# Altium schematic sheet T-LOG v1.1.SchDoc
size 209 x 297 mm
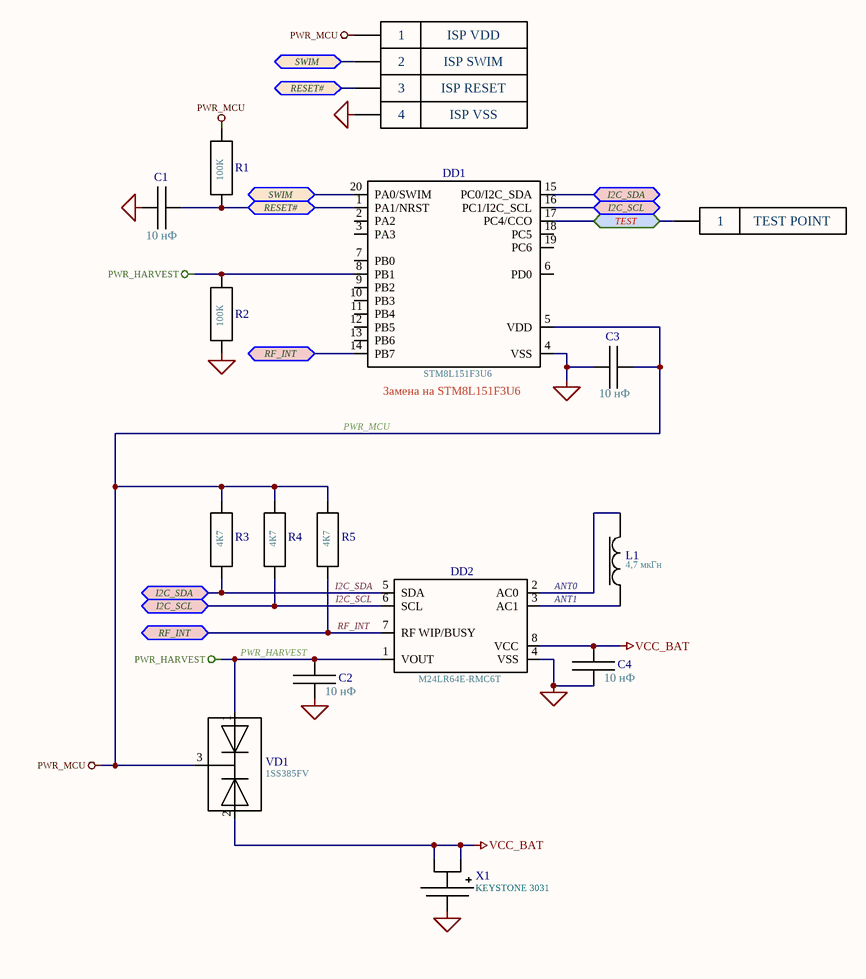
[diagram p0: T-LOG v1.1.SchDoc]

## Parts
C1  10 нФ  [C0402]
C2  10 нФ  [C0402]
C3  10 нФ  [C0402]
C4  10 нФ  [C0402]
DD1  STM8L151F3U6  [UFQPN20_3x3_0.5]
DD2  M24LR64E-RMC6T  [UDFN-8_2X3]
K1  ISP  [THRU_HOLE_02x045]  (value not drawn)  (no BOM)
K2  ISP  [THRU_HOLE_02x045]  (value not drawn)  (no BOM)
K3  ISP  [THRU_HOLE_02x045]  (value not drawn)  (no BOM)
K4  ISP  [THRU_HOLE_02x045]  (value not drawn)  (no BOM)
K5  TEST POINT  [THRU_HOLE_02x045]  (value not drawn)  (no BOM)
L1  4,7 мкГн  [WE-LQ_1210]
R1  100К  [R0402]
R2  100К  [R0402]
R3  4К7  [R0402]
R4  4К7  [R0402]
R5  4К7  [R0402]
VD1  1SS385FV  [SOT-723]
X1  KEYSTONE 3031  [KEYSTONE_3031]

## Ports
I2C_SCL (bidir), I2C_SDA (bidir), RESET# (bidir), RF_INT (bidir), SWIM (bidir), TEST (bidir)

## Nets
GND: C1.1 C2.1 C3.2 C4.1 DD1.4(VSS) DD2.4(VSS) K4.1 R2.1 X1.3
PWR_HARVEST: C2.2 DD1.8(PB1) DD2.1(VOUT) R2.2 VD1.1
PWR_MCU: C3.1 DD1.5(VDD) K1.1 R1.2 R3.2 R4.2 R5.2 VD1.3
VCC_BAT: C4.2 DD2.8(VCC) VD1.2 X1.1 X1.2
ANT0: DD2.2(AC0) L1.2
ANT1: DD2.3(AC1) L1.1
I2C_SCL: DD1.16(PC1/I2C_SCL) DD2.6(SCL) R4.1 ; port I2C_SCL
I2C_SDA: DD1.15(PC0/I2C_SDA) DD2.5(SDA) R3.1 ; port I2C_SDA
RESET#: C1.2 DD1.1(PA1/NRST) K3.1 R1.1 ; port RESET#
RF_INT: DD1.14(PB7) DD2.7(RF_WIP/BUSY) R5.1 ; port RF_INT
SWIM: DD1.20(PA0/SWIM) K2.1 ; port SWIM
TEST: DD1.17(PC4/CCO) K5.1 ; port TEST

Not connected (* = marked no-connect by the designer): DD1 2(PA2) 3(PA3) 6(PD0) 7(PB0) 9(PB2) 10(PB3) 11(PB4) 12(PB5) 13(PB6) 18(PC5) 19(PC6)

## Notes on the sheet
- 1
- 2
- ISP VDD
- ISP SWIM
- 3
- 4
- ISP RESET
- ISP VSS
- (near K5) 1
- TEST POINT
- (near DD1) Замена на STM8L151F3U6
- Перв. Примен.
- Справ. №
- Н.контр.
- Подп и дата
- Инв.№ дубл.
- Взам. инв.№
- Изм.
- Лист
- № докум.
- Подп.
- Дата
- Лит.
- Масса.
- Масштаб
- Пров.
- Т.Контр.
- Разраб.
- Схема электрическая
- принципиальная
- Листов
- б/м
- Инв.№подп.
- Н.Контр.
- Утв.
- Копировал:
- Формат А4

## Library data of the parts
C1-C4 = C0402: Чип-конденсатор 0,01 мкФ 50 В 0402; TYPE: Чип-конденсатор 0402
DD1 = STM8L151F3U6: Микроконтроллер  STM8L151F3U6 UFQFPN-20
DD2 = M24LR64E-RMC6T: Память EEPROM I2C/NFC 64Кбит M24LR64E-RMC6T UFDFN8 ST
K1-K4 = THRU_HOLE_02x045: used for STM8L ISP in T-LOG project
K5 = THRU_HOLE_02x045
L1 = WE-LQ_744032004: Чип-индуктивность WE-LQ 744032004 4,7 мкГн 0,49 А Wurth Elektronik; TYPE: LQM2HPN2R2MJ0
R1 R2 = R0402: Чип-резистор 100 кОм 5% 0402; TYPE: Чип-резистор 0402
R3-R5 = R0402: Чип-резистор 4,7 кОм 5% 0402; TYPE: Чип-резистор 0402
VD1 = 1SS385FV: Диодная сборка с общим катодом 1SS385FV SOT-723 Toshiba
X1 = KEYSTONE_3031: Держатель элемента CR1025 KEYSTONE 3031